# EAGLE design source_bt_rev_a (EAGLE 6.1)
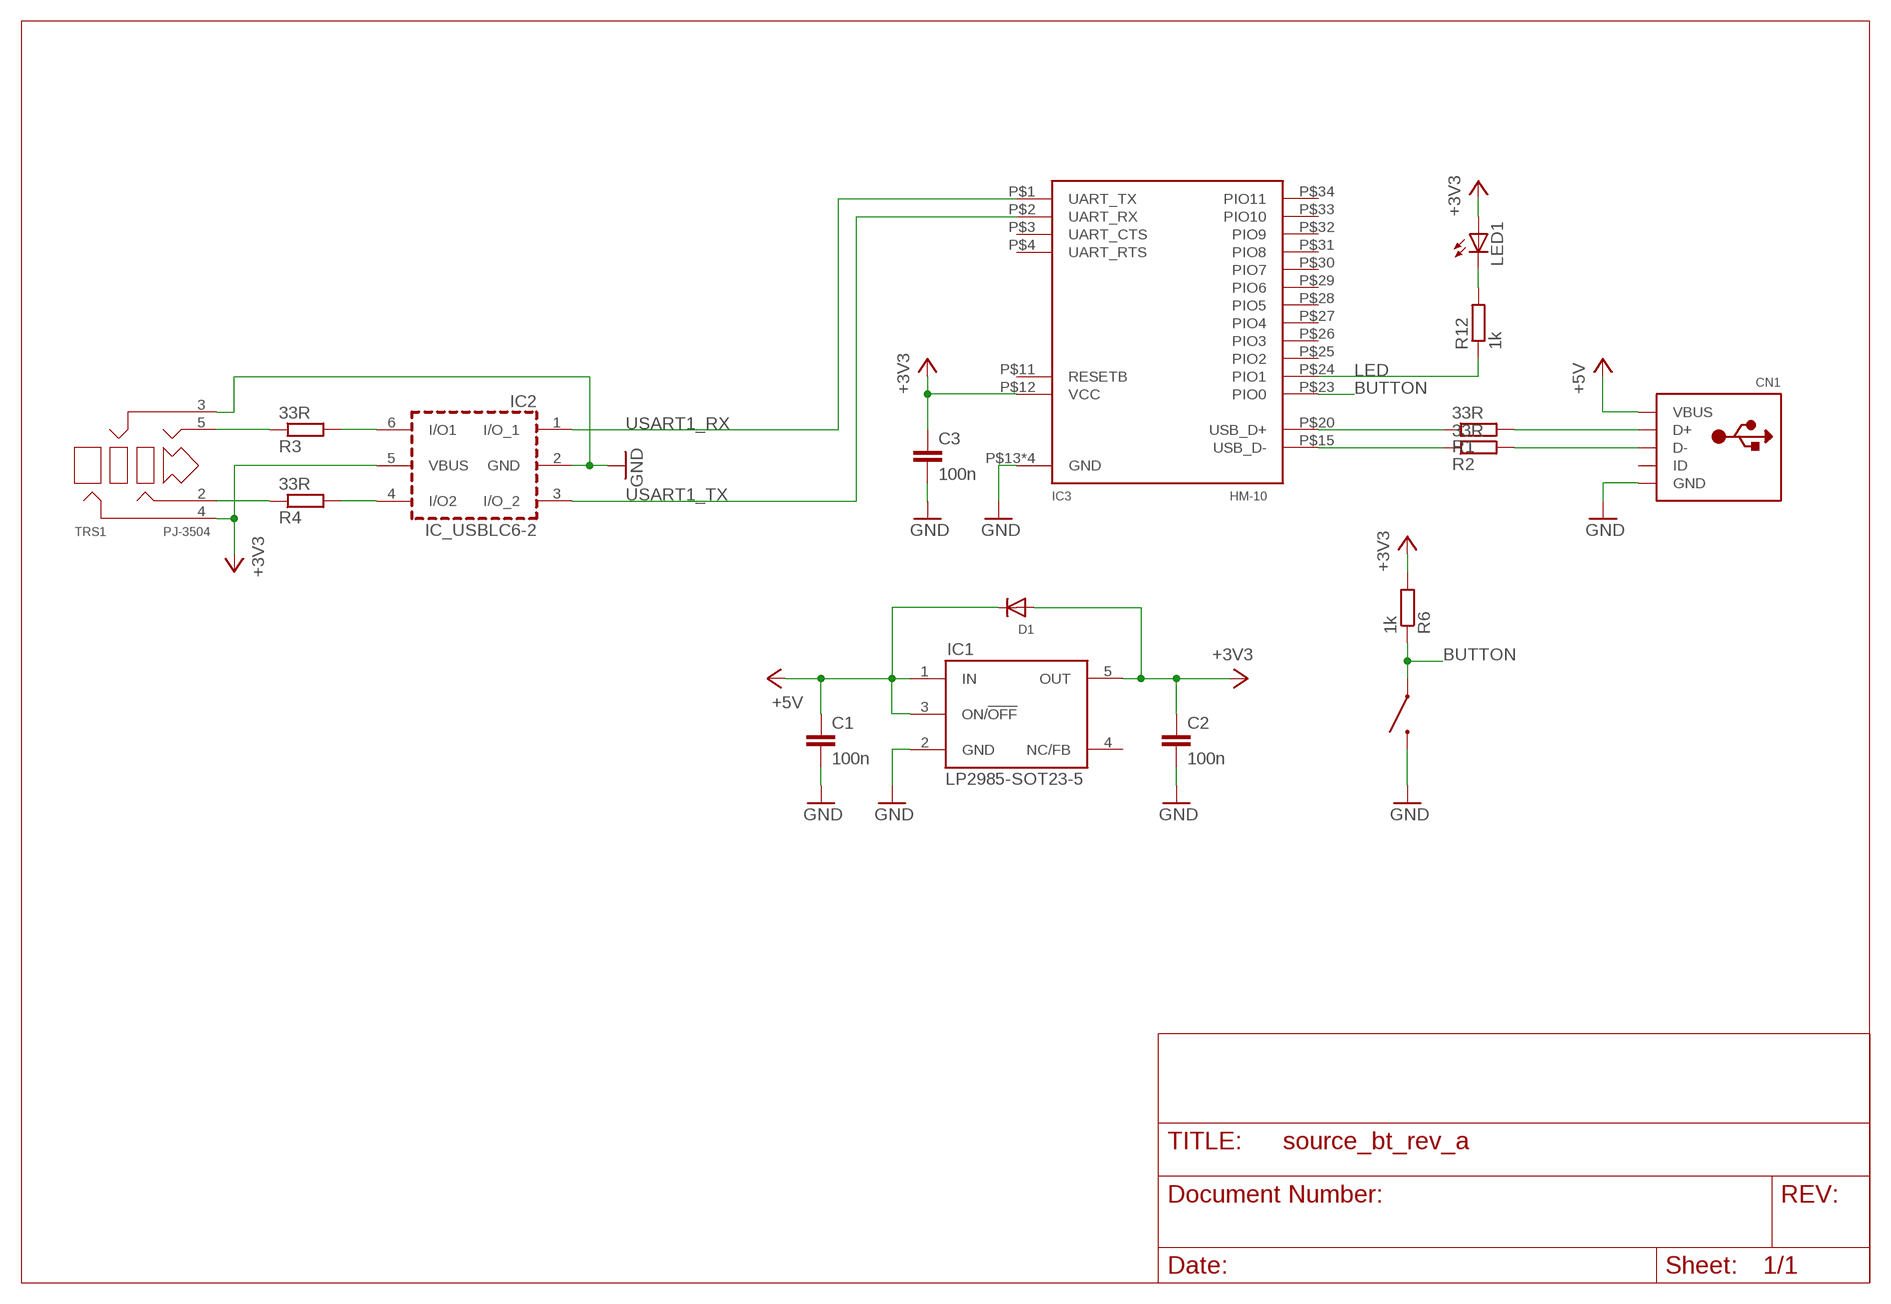
[diagram p0: schematic, sheet 1]

## Parts
C1  100n  C-EUC0603  [C0603]
C2  100n  C-EUC0603  [C0603]
C3  100n  C-EUC0603  [C0603]
CN1  USBMINIB  [USB-MINIB]
D1  DIODESOD-323  [SOD-323]
IC1  LP2985-SOT23-5  [SOT23-5]
IC2  IC_USBLC6-2  [SOT-23-6L]
IC3  HM-10  [HM-10]
ISP  TACT-SWITCH-40-40  [40-40]
LED1  LEDCHIP-LED0603  [CHIP-LED0603]
R1  33R  R-EU_R0603  [R0603]
R2  33R  R-EU_R0603  [R0603]
R3  33R  R-EU_R0603  [R0603]
R4  33R  R-EU_R0603  [R0603]
R6  1k  R-EU_R0603  [R0603]
R12  1k  R-EU_R0603  [R0603]
TRS1  PJ-3504  [YD-PJ-3504]

## Nets
+3V3: C2.1 C3.1 D1.A IC1.5(OUT) IC2.5(VBUS) IC3.P$12(VCC) LED1.A R6.2 TRS1.4
+5V: C1.1 CN1.VBUS D1.C IC1.1(IN) IC1.3(ON/!OFF)
BUTTON: IC3.P$23(PIO0) ISP.3 ISP.4 R6.1
GND: C1.2 C2.2 C3.2 CN1.GND IC1.2(GND) IC2.2(GND) IC3.P$13(GND) IC3.P$14(GND) IC3.P$21(GND) IC3.P$22(GND) ISP.1 ISP.2 TRS1.3
LED: IC3.P$24(PIO1) R12.1
N$1: IC3.P$20(USB_D+) R1.1
N$2: IC3.P$15(USB_D-) R2.1
N$3: CN1.D+ R1.2
N$4: CN1.D- R2.2
N$7: IC2.6(I/O1) R3.2
N$11: LED1.C R12.2
N$12: R4.1 TRS1.2
N$25: IC2.4(I/O2) R4.2
N$28: R3.1 TRS1.5
USART1_RX: IC2.1(I/O_1) IC3.P$1(UART_TX)
USART1_TX: IC2.3(I/O_2) IC3.P$2(UART_RX)
Unconnected: CN1.ID IC1.4(NC/FB) IC3.P$3(UART_CTS) IC3.P$4(UART_RTS) IC3.P$11(RESETB) IC3.P$25(PIO2) IC3.P$26(PIO3) IC3.P$27(PIO4) IC3.P$28(PIO5) IC3.P$29(PIO6) IC3.P$30(PIO7) IC3.P$31(PIO8) IC3.P$32(PIO9) IC3.P$33(PIO10) IC3.P$34(PIO11)

## Library data of the parts
C1-C3 = rcl:C-EU: CAPACITOR, European symbol
CN1 = microbuilder:USB: USB Connectors USBMINIB - Surface Mount Female Mini-B USB Connector 4UConnector: 06564
D1 = microbuilder:DIODE: Diode SMA Model Volts Amps Type Vf Vr Digikey # Notes SSA34-E3 40V 3A Schottky 480mV @ 3A 200uA @ 40V SSA34-E3/61TGITR-ND CDBA120-G 20V 1A Schottky 500mV @ 1A 500uA @ 20V 641-1014-6-ND REEL MBRA210 10V 2A Schottky 350mV @ 2A 700uA @ 10V MBRA210LT3 SOD-123 Model Volts Amps Type Vf Vr Order # Notes BAT54T1G 30V 200mA Schottky 800mV @ 200mA 2uA @ 25V BAT54T1GOSTR-ND B0530W 30V 500mA Schottky 430mV @ 500mA 130uA @ 30V B0530W-FDICT-ND REEL MBR120 1A 20V Schottky 340mV @ 1A MBR120VLSFT1GOSCT-ND SOD-323 Model Volts Amps Type Vf Vr Order # Notes PMEG2005EJ 20V 500mA Schottky 355mV @ 500mA 568-4110-1-ND ZLLS410 10V 570mA Schottky 380mV @ 570mA ZLLS410CT-ND 1N4148WS 75V 150mA Silicon/Simple 1V 1N4148WSFSCT-ND REEL SOD-523 Model Volts Amps Type Vf Vr Order # Notes BAT54XV2 30V 200mA Schottky 0.8V @ 100mA BAT54XV2CT-ND TB751S 30V 30mA Schottky RB751S-40TE61CT-ND SOT23-R/W (R = Solder Paste/Reflow Ovens, W = Hand-Soldering) Model Volts Amps Type Vf Vr Order # Notes BAT54FILM 40V 300mA Schottky 497-7162-1-ND
IC1 = vreg:LP2985
IC2 = dp_devices:IC_USBLC6-2
IC3 = bt:HM-10
ISP = tactile-switch:TACT-SWITCH-40-40
LED1 = led:LED: LED OSRAM: - CHIPLED LG R971, LG N971, LY N971, LG Q971, LY Q971, LO R971, LY R971 LH N974, LH R974 LS Q976, LO Q976, LY Q976 LO Q996 - Hyper CHIPLED LW Q18S LB Q993, LB Q99A, LB R99A - SideLED LS A670, LO A670, LY A670, LG A670, LP A670 LB A673, LV A673, LT A673, LW A673 LH A674 LY A675 LS A676, LA A676, LO A676, LY A676, LW A676 LS A679, LY A679, LG A679 - Hyper Micro SIDELED® LS Y876, LA Y876, LO Y876, LY Y876 LT Y87S - SmartLED LW L88C, LW L88S LB L89C, LB L89S, LG L890 LS L89K, LO L89K, LY L89K LS L896, LA L896, LO L896, LY L896 - TOPLED LS T670, LO T670, LY T670, LG T670, LP T670 LSG T670, LSP T670, LSY T670, LOP T670, LYG T670 LG T671, LOG T671, LSG T671 LB T673, LV T673, LT T673, LW T673 LH T674 LS T676, LA T676, LO T676, LY T676, LB T676, LH T676, LSB T676, LW T676 LB T67C, LV T67C, LT T67C, LS T67K, LO T67K, LY T67K, LW E67C LS E67B, LA E67B, LO E67B, LY E67B, LB E67C, LV E67C, LT E67C LW T67C LS T679, LY T679, LG T679 LS T770, LO T770, LY T770, LG T770, LP T770 LB T773, LV T773, LT T773, LW T773 LH T774 LS E675, LA E675, LY E675, LS T675 LS T776, LA T776, LO T776, LY T776, LB T776 LHGB T686 LT T68C, LB T68C - Hyper Mini TOPLED® LB M676 - Mini TOPLED Santana® LG M470 LS M47K, LO M47K, LY M47K Source: http://www.osram.convergy.de LUXEON: - LUMILED® LXK2-PW12-R00, LXK2-PW12-S00, LXK2-PW14-U00, LXK2-PW14-V00 LXK2-PM12-R00, LXK2-PM12-S00, LXK2-PM14-U00 LXK2-PE12-Q00, LXK2-PE12-R00, LXK2-PE12-S00, LXK2-PE14-T00, LXK2-PE14-U00 LXK2-PB12-K00, LXK2-PB12-L00, LXK2-PB12-M00, LXK2-PB14-N00, LXK2-PB14-P00, LXK2-PB14-Q00 LXK2-PR12-L00, LXK2-PR12-M00, LXK2-PR14-Q00, LXK2-PR14-R00 LXK2-PD12-Q00, LXK2-PD12-R00, LXK2-PD12-S00 LXK2-PH12-R00, LXK2-PH12-S00 LXK2-PL12-P00, LXK2-PL12-Q00, LXK2-PL12-R00 Source: www.luxeon.com KINGBRIGHT: KA-3528ASYC Source: www.kingbright.com
R1-R4 R6 R12 = rcl:R-EU_: RESISTOR, European symbol
TRS1 = con-trs:PJ-3504

## Board
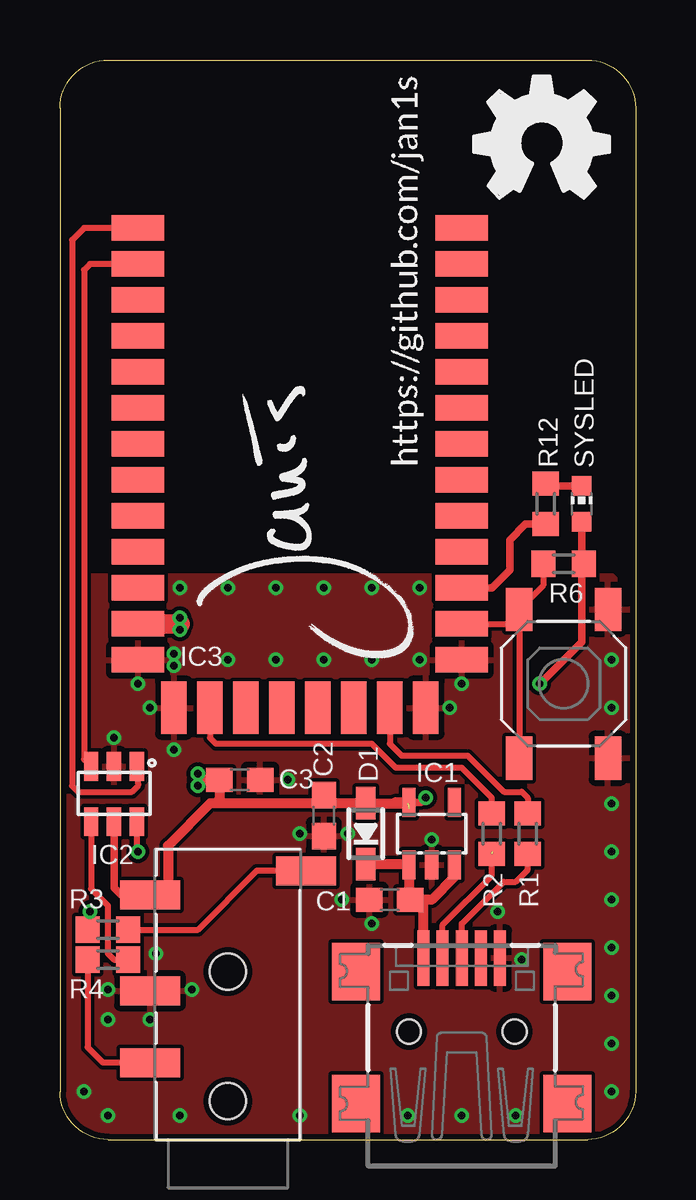
[diagram p1: board, top side]
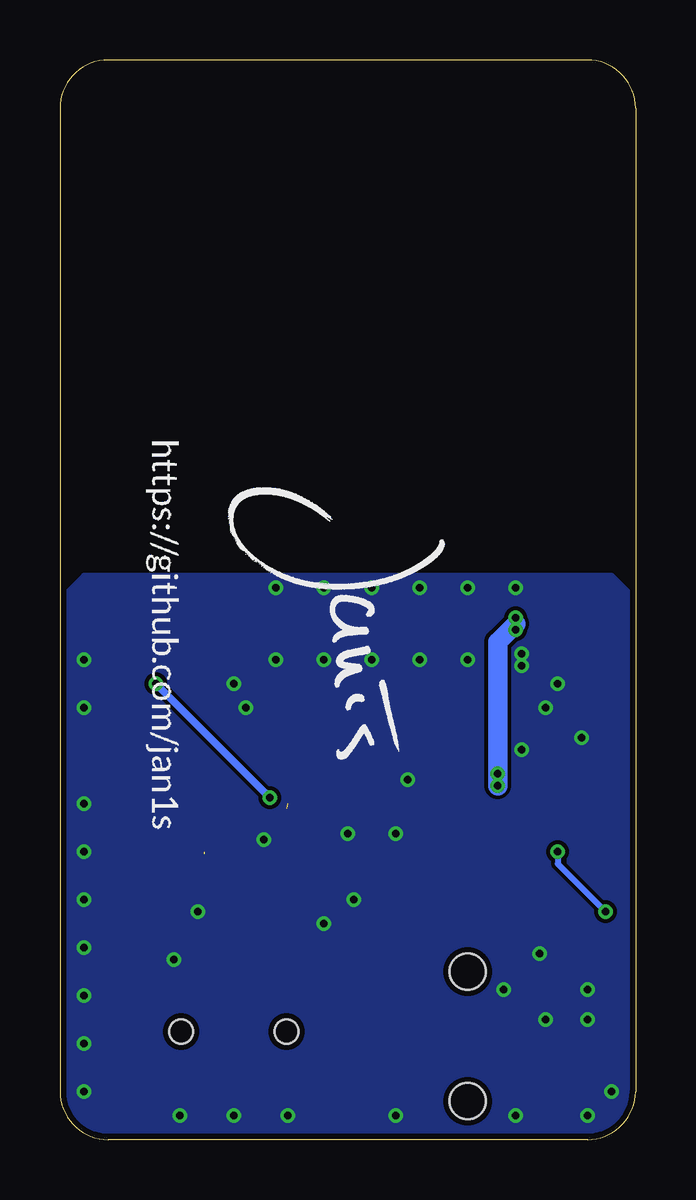
[diagram p2: board, bottom side, seen from below]

Size 24 x 45 mm. Coordinates in mm from the lower left corner, seen from the top.
Outline: 2,0 22,0 arc90 24,2 24,43 arc90 22,45 2,45 arc90 0,43 0,2 arc90 2,0
Copper layers (1*16): Top 0.035mm / dielectric 1.5mm / Bottom 0.035mm
Design rules: minimum track width 6mil, minimum drill 12mil, track to track 6mil, track to pad 6mil, pad to pad 6mil, via to via 6mil, smd to smd 0mil, copper to edge 10mil, drill to drill 10mil, minimum pad ring 10mil, minimum via ring 6mil, stop-mask expansion 2mil, vias tented up to drill 100mil, thermal gap 10mil

### Footprints (pad centres in the part's own frame; a part is rotated, then mirrored left to right if it is on the bottom)
C0603 = smd 1.1 x 1: 1 -0.85,0; 2 0.85,0
USB-MINIB = smd 0.5 x 2.308: D+ 0,4.064; D- -0.8,4.064; GND 1.6,4.064; ID 0.8,4.064; VBUS -1.6,4.064 | smd 2 x 2.4: GND1 -4.4,-2; GND2 -4.4,3.5; GND3 4.4,3.5; GND4 4.4,-2 | hole 1: -2.2,1; 2.2,1
SOD-323 = smd 1.35 x 0.8: A 1.27,0; C -1.27,0
SOT23-5 = smd 0.55 x 1.2: 1 -0.95,-1.3; 2 0,-1.3; 3 0.95,-1.3; 4 0.95,1.3; 5 -0.95,1.3
SOT-23-6L = smd 0.6 x 1.2: 1 -0.95,-2.3; 2 0,-2.3; 3 0.95,-2.3; 4 0.95,0; 5 0,0; 6 -0.95,0
HM-10 = smd 2.184 x 1.067: P$1 -6.75,0; P$2 -6.75,-1.5; P$3 -6.75,-3; P$4 -6.75,-4.5; P$5 -6.75,-6; P$6 -6.75,-7.5; P$7 -6.75,-9; P$8 -6.75,-10.5; P$9 -6.75,-12; P$10 -6.75,-13.5; P$11 -6.75,-15; P$12 -6.75,-16.5; P$13 -6.75,-18; P$22 6.75,-18; P$23 6.75,-16.5; P$24 6.75,-15; P$25 6.75,-13.5; P$26 6.75,-12; P$27 6.75,-10.5; P$28 6.75,-9; P$29 6.75,-7.5; P$30 6.75,-6; P$31 6.75,-4.5; P$32 6.75,-3; P$33 6.75,-1.5; P$34 6.75,0 | smd 1.067 x 2.184: P$14 -5.25,-20; P$15 -3.75,-20; P$16 -2.25,-20; P$17 -0.75,-20; P$18 0.75,-20; P$19 2.25,-20; P$20 3.75,-20; P$21 5.25,-20
40-40 = smd 1.8 x 1.1: 1 -3.1,1.85; 2 3.1,1.85; 3 -3.1,-1.85; 4 3.1,-1.85
CHIP-LED0603 = smd 0.8 x 0.8: A 0,-0.75; C 0,0.75
R0603 = smd 1 x 1.1: 1 -0.85,0; 2 0.85,0
YD-PJ-3504 = smd 1.2 x 2.5: 2 3.2,3.25; 3 6.2,3.25; 4 10.2,3.25; 5 11.2,-3.25 | hole 1.5: 1.6,0; 7,0

### Placement (x,y rotation side)
C1  13.75,10 180 top
C2  11,13.5 270 top
C3  7.5,15 0 top
CN1  16.75,3.5 0 top
D1  12.75,12.75 90 top
IC1  15.5,12.75 0 top
IC2  2.25,13.25 180 top
IC3  10,38 0 top
ISP  21,19 270 top
LED1  21.75,26.5 0 top
LOGO1  OSHW_LOGO_FILLX0200-NT  [OSHW_FILLX200_NOTEXT]  17.25,39.25 0 top
R1  19.5,12.75 270 top
R2  18,12.75 270 top
R3  2,8.75 180 top
R4  2,7.5 0 top
R6  21,24 0 top
R12  20.25,26.5 90 top
TRS1  7,0 90 top
U$1  [JANIS_10MM]  15,19.75 90 top
U$2  [JANIS_10MM]  17.25,27.5 270 bottom
U$5  [GITHUB/JAN1S]  15,28 90 top
U$6  [GITHUB/JAN1S]  20.25,29.25 270 bottom

### Tracks (layer width: path | path; a pad name or v marks a point on that pad's centre or on a via)
+3V3  (via drill 0.32)  (1 unrouted)
  Top 0.305: IC1.5 15.05,14.05 v15.25,14.25 | v20,19 21.75,20.75 21.75,23.9 R6.2 21.75,24.1 LED1.A | IC2.5 2.25,10.5 2.55,10.2 TRS1.4 3.95,10.2 4.5,10.75
  Top 0.406: 14.55,13.8 14.5,13.75 | 13.95,14.05 IC1.5 14.52,14.02 D1.A 11,14.02 | TRS1.4 3.75,10 | C2.1 11,14.02 | 11,14.02 6.5,14.02 | 6.5,14.02 6.27,14.02 4.5,12.25 4.5,10.75 | 6.5,14.02 6.65,14.17 C3.1 6,15 | 6,15 v5.75,15.25 | IC3.P$12 3.5,21.75 3.75,21.5 | 6,15 v5.75,14.75 | v5,21.75 5,21.5 v5,21.25
  Top 0.813: 5,21.5 3.75,21.5
  Bottom 0.305: v15.25,14.25 v20,19
  Bottom 0.406: v5,21.75 5,21.5 v5,21.25
  Bottom 0.813: 5,21.5 5.75,20.75 v5.75,15.25 v5.75,14.75
+5V
  Top 0.406: IC1.3 16.45,10.95 15.5,10 15.25,10 | 15.25,10 C1.1 14.55,10.05 IC1.1 14.52,11.48 D1.C | CN1.VBUS 15.15,9.9 15.25,10
BUTTON
  Top 0.254: IC3.P$23 19,21.5 | ISP.4 ISP.3 20.15,23.1 R6.1
  Top 0.406: ISP.3 19.15,21.65 19,21.5
GND  (via drill 0.32)
  other vias: 2.25,16.75 9.5,15 18.25,9.5 19.25,7.5 15.5,12.5 11.75,10 16.75,19 16.25,18 3.25,19 3.75,18 3.75,5 5.5,6.25 2,6.25 5,23 4.75,20.25 15,20 15,23 7,20 9,20 11,20 13,20 10,12.75 13,9 12,12.75 4.75,16.25 4.75,19.75 23,20 23,18 23,14 23,12 23,10 23,8 23,6 23,4 23,2 19,1 16.75,1 14.5,1 10,1 4,7.75 5,1 2,5 1,2 2,1 7,23 9,23 11,23 13,23
  pour Top (rank 5): 1,23.5 23,23.5 24,22.5 24,1 23,0 1,0 0,1 0,22.5
  pour Bottom: 1,23.5 23,23.5 24,22.5 24,1 23,0 21.5,0 21.5,-1 16,-1 16,0 1,0 0,1 0,22.5
LED
  Top 0.305: IC3.P$24 18,23 18.75,23.75 18.75,25 19.4,25.65 R12.1
N$1
  Top 0.254: R1.1 19.5,14.25 19.25,14.5 18.5,14.5 17,16 14.25,16 13.75,16.5 IC3.P$20
N$2
  Top 0.254: R2.1 18,14.25 16.75,15.5 14,15.5 13,16.5 6.5,16.5 6.25,16.75 IC3.P$15
N$3
  Top 0.254: CN1.D+ 16.75,9 18.5,10.75 19,10.75 19.5,11.25 R1.2
N$4  (1 unrouted)
  Top 0.254: CN1.D- 15.95,8.95 18,11 18,12
N$7  (via drill 0.32)
  Top 0.254: IC2.6 3.2,12.05 v3.25,12 | 1.5,8.35 R3.2 1.25,8.9 v1.25,9.5
  Bottom 0.254: v3.25,12 3.25,11.5 v1.25,9.5
N$11
  Top 0.305: LED1.C 20.35,27.25 R12.2
N$12
  Top 0.254: TRS1.2 1.8,3.2 1.15,3.85 R4.1
N$25
  Top 0.254: R4.2 2.25,7.5 2,7.75 2,9.75 1.3,10.45 IC2.4
N$28
  Top 0.254: R3.1 5.75,8.75 8.2,11.2 TRS1.5
USART1_RX
  Top 0.254: IC3.P$1 1,38 0.5,37.5 0.5,14.75 0.75,14.5 3,14.5 3.25,14.75 3.2,15.3 IC2.1
USART1_TX
  Top 0.254: IC3.P$2 1.25,36.5 1,36.25 1,15.85 IC2.3

### Text on the board
tNames: SYSLED